# EAGLE design led-cc-driver-mk-1.1 (EAGLE 6.5.0)
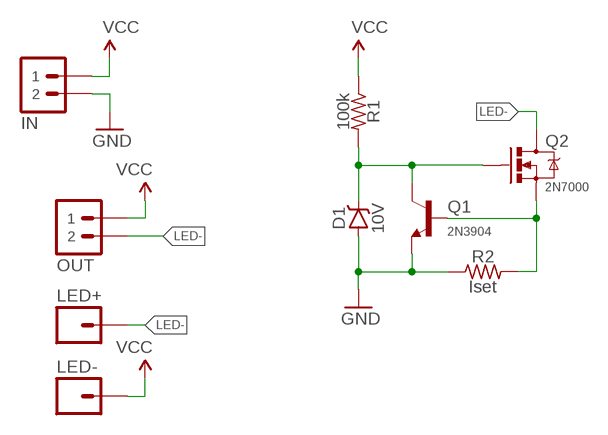
[diagram p0: schematic, sheet 1]

## Parts
D1  10V  DIODE-ZENER7.62MM-PTH  [DIODE-ZENNER-7.62MM]
IN  M02JST-PTH-RA-SMALLPADS  [JST-2-PH-RA-PTH-SMALLPADS]
LED+  M01PTH  [1X01]
LED-  M01PTH  [1X01]
OUT  M02JST-PTH-RA-SMALLPADS  [JST-2-PH-RA-PTH-SMALLPADS]
Q1  2N3904  TRANSISTOR_NPNTO-92-AMMO-EBC  [TO-92-AMMO]
Q2  2N7000  MOSFET-NCHANNEL2N7000-AMMO  [TO-92-AMMO]
R1  100k  RESISTORPTH-AXIAL-7.62MM  [RESISTOR-AXIAL-PTH-7.62MM]
R2  Iset  RESISTORPTH-AXIAL-10.16MM  [RESISTOR-AXIAL-PTH-10.16MM]

## Nets
BASE: Q1.2(B) Q2.1(S) R2.P$2
GATE: D1.K(C) Q1.3(C) Q2.2(G) R1.P$2
GND: D1.A IN.2 Q1.1(E) R2.P$1
LED-: LED+.1 OUT.2 Q2.3(D)
VCC: IN.1 LED-.1 OUT.1 R1.P$1

## Library data of the parts
D1 = A_butts:DIODE-ZENER: Zener Diode Production Part - 8199 3.4V Zener Voltage
IN OUT = A_butts:M02: Standard 2-pin 0.1" header. Use with - straight break away headers ( PRT-00116) - right angle break away headers (PRT-00553) - swiss pins (PRT-00743) - machine pins (PRT-00117) - female headers (PRT-00115) Molex polarized connector foot print use with: PRT-08233 with associated crimp pins and housings. 2.54_SCREWTERM for use with PRT-10571. 3.5mm Screw Terminal footprints for PRT-08084 5mm Screw Terminal footprints for use with PRT-08433
LED+ LED- = A_butts:M01: Header 1 Standard 1-pin 0.1" header. Use with straight break away headers (SKU : PRT-00116), right angle break away headers (PRT-00553), swiss pins (PRT-00743), machine pins (PRT-00117), and female headers (PRT-00115).
Q1 = A_butts:TRANSISTOR_NPN: Generic NPN BJT MMBT2222A - TRANS-08049 (SOT-23, 1A 40V) MPSA42 - TRANS-09116 (SOT-23, 500mA 300V) MMBT5088LT1G - TRANS-11160 (SOT-23, 50 mA 30V) BC547 - COM-08928 <http://www.sparkfun.com/products/8928> (TO-92 45V 100mA) (1.Collector 2.Base 3.Emitter) 2N3904 - COM-00521 <http://www.sparkfun.com/products/521> (TO-92 40V 200mA) (1.Emitter 2.Base 3.Collector) P2N2222A - COM-12852 <http://www.sparkfun.com/products/12852> (TO-92 40V 600mA) (1.Collector 2.Base 3.Emitter)
Q2 = A_butts:MOSFET-NCHANNEL: Common NMOSFET Parts MFG P/N Store ID Prod ID FDD8780 TRANS-09984 SI7820DN TRANS-11055 FDS6630A IC-08089 2N7002PW TRANS-11151 FQP30N06L COM-10213 TRANS-10060 BSS123LT1G TRANS-08345 BSS138 TRANS-00830 BS170 2N7000
R1 R2 = A_butts:RESISTOR: RESISTOR, American symbol

## Board
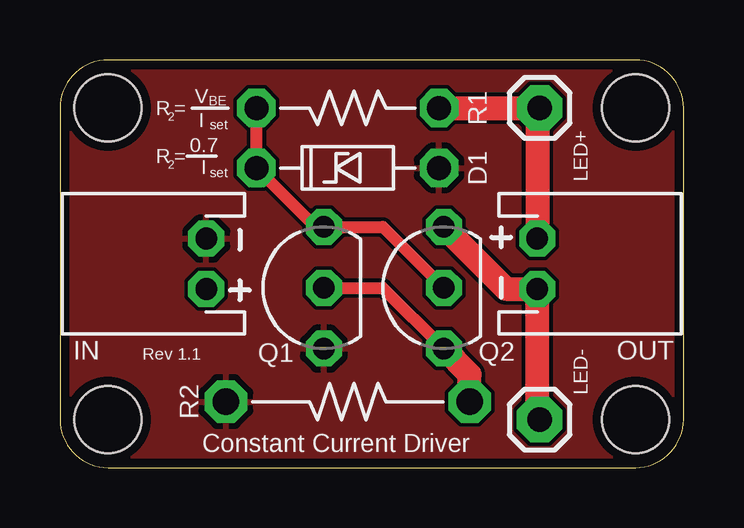
[diagram p1: board, top side]
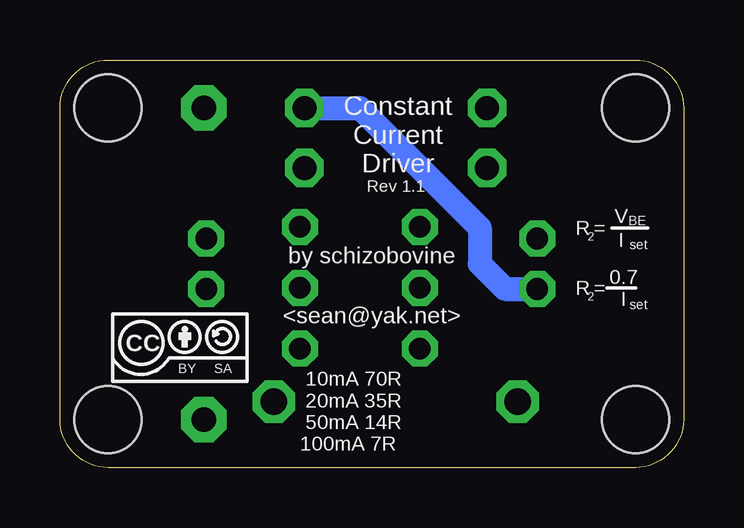
[diagram p2: board, bottom side, seen from below]

Size 26 x 17 mm. Coordinates in mm from the lower left corner, seen from the top.
Outline: 0,15 0,2 arc90 2,0 24,0 arc90 26,2 26,15 arc90 24,17 2,17 arc90 0,15
Copper layers (1*16): Top 0.0356mm / dielectric 1.5011mm / Bottom 0.0356mm
Design rules "LaenPCBOrder_2": minimum track width 6mil, minimum drill 13mil, track to track 6mil, track to pad 6mil, pad to pad 6mil, via to via 6mil, smd to smd 6mil, copper to edge 15mil, drill to drill 6mil, minimum pad ring 7mil, minimum via ring 7mil, stop-mask expansion 3mil, vias tented up to drill 20mil, thermal gap 10mil
Holes 2.8 mm at 2,15 2,2 24,2 24,15

### Footprints (pad centres in the part's own frame; a part is rotated, then mirrored left to right if it is on the bottom)
DIODE-ZENNER-7.62MM = drill 1 pad 1.6 octagon: A -3.81,0; K 3.81,0
JST-2-PH-RA-PTH-SMALLPADS = drill 0.9 pad 1.5 octagon: 1 -1.05,0; 2 1.05,0
1X01 = drill 1.016 pad 1.88 octagon: 1 0,0
TO-92-AMMO = drill 0.9 pad 1.5 octagon: 1 -2.54,0; 2 0,0; 3 2.54,0
RESISTOR-AXIAL-PTH-7.62MM = drill 1 pad 1.6 octagon: P$1 -3.81,0; P$2 3.81,0
RESISTOR-AXIAL-PTH-10.16MM = drill 1.1 pad 1.778 octagon: P$1 -5.08,0; P$2 5.08,0

### Placement (x,y rotation side)
D1  12,12.5 180 top
IN  6.1,8.5 90 top
LED+  20,2 0 top
LED-  20,15 180 top
OUT  19.9,8.5 270 top
Q1  11,7.5 90 top
Q2  16,7.5 90 top
R1  12,15 180 top
R2  12,2.75 0 top
U$4  [CC-BY-SA-4.0-NO-URL]  21,5 0 bottom

### Tracks (layer width: path | path; a pad name or v marks a point on that pad's centre or on a via)
BASE
  Top 0.5: Q1.2 13.46,7.5 Q2.1
  Top 1: R2.P$2 17.08,3.88 Q2.1
GATE
  Top 0.5: Q2.2 13.46,10.04 Q1.3 10.65,10.04 D1.K R1.P$2
GND
  pour Top: 24,0 2,0 arc-90 0,2 0,15 arc-90 2,17 24,17 arc-90 26,15 26,2 arc-90
LED-
  Top 1: Q2.3 18.59,7.45 OUT.2 19.9,2.1 LED+.1
VCC
  Top 1: R1.P$1 LED-.1 19.9,14.9 OUT.1
  Bottom 1: R1.P$1 13.5,15 8.5,10 8.5,8.5 7.45,7.45 IN.1

### Text on the board
tPlace: V | BE | R | 2 | = | I | set | R | 2 | = | 0.7 / I | set | Constant Current Driver
bPlace: Constant / Current / Driver | set | BE | I | V | = | 2 | R | by schizobovine | 0.7 / I | = | R | set | 2 | <sean@yak.net> | 10mA 70R / 20mA 35R / 50mA 14R / 100mA 7R